# Altium schematic sheet M3_FMCW.SchDoc
size C
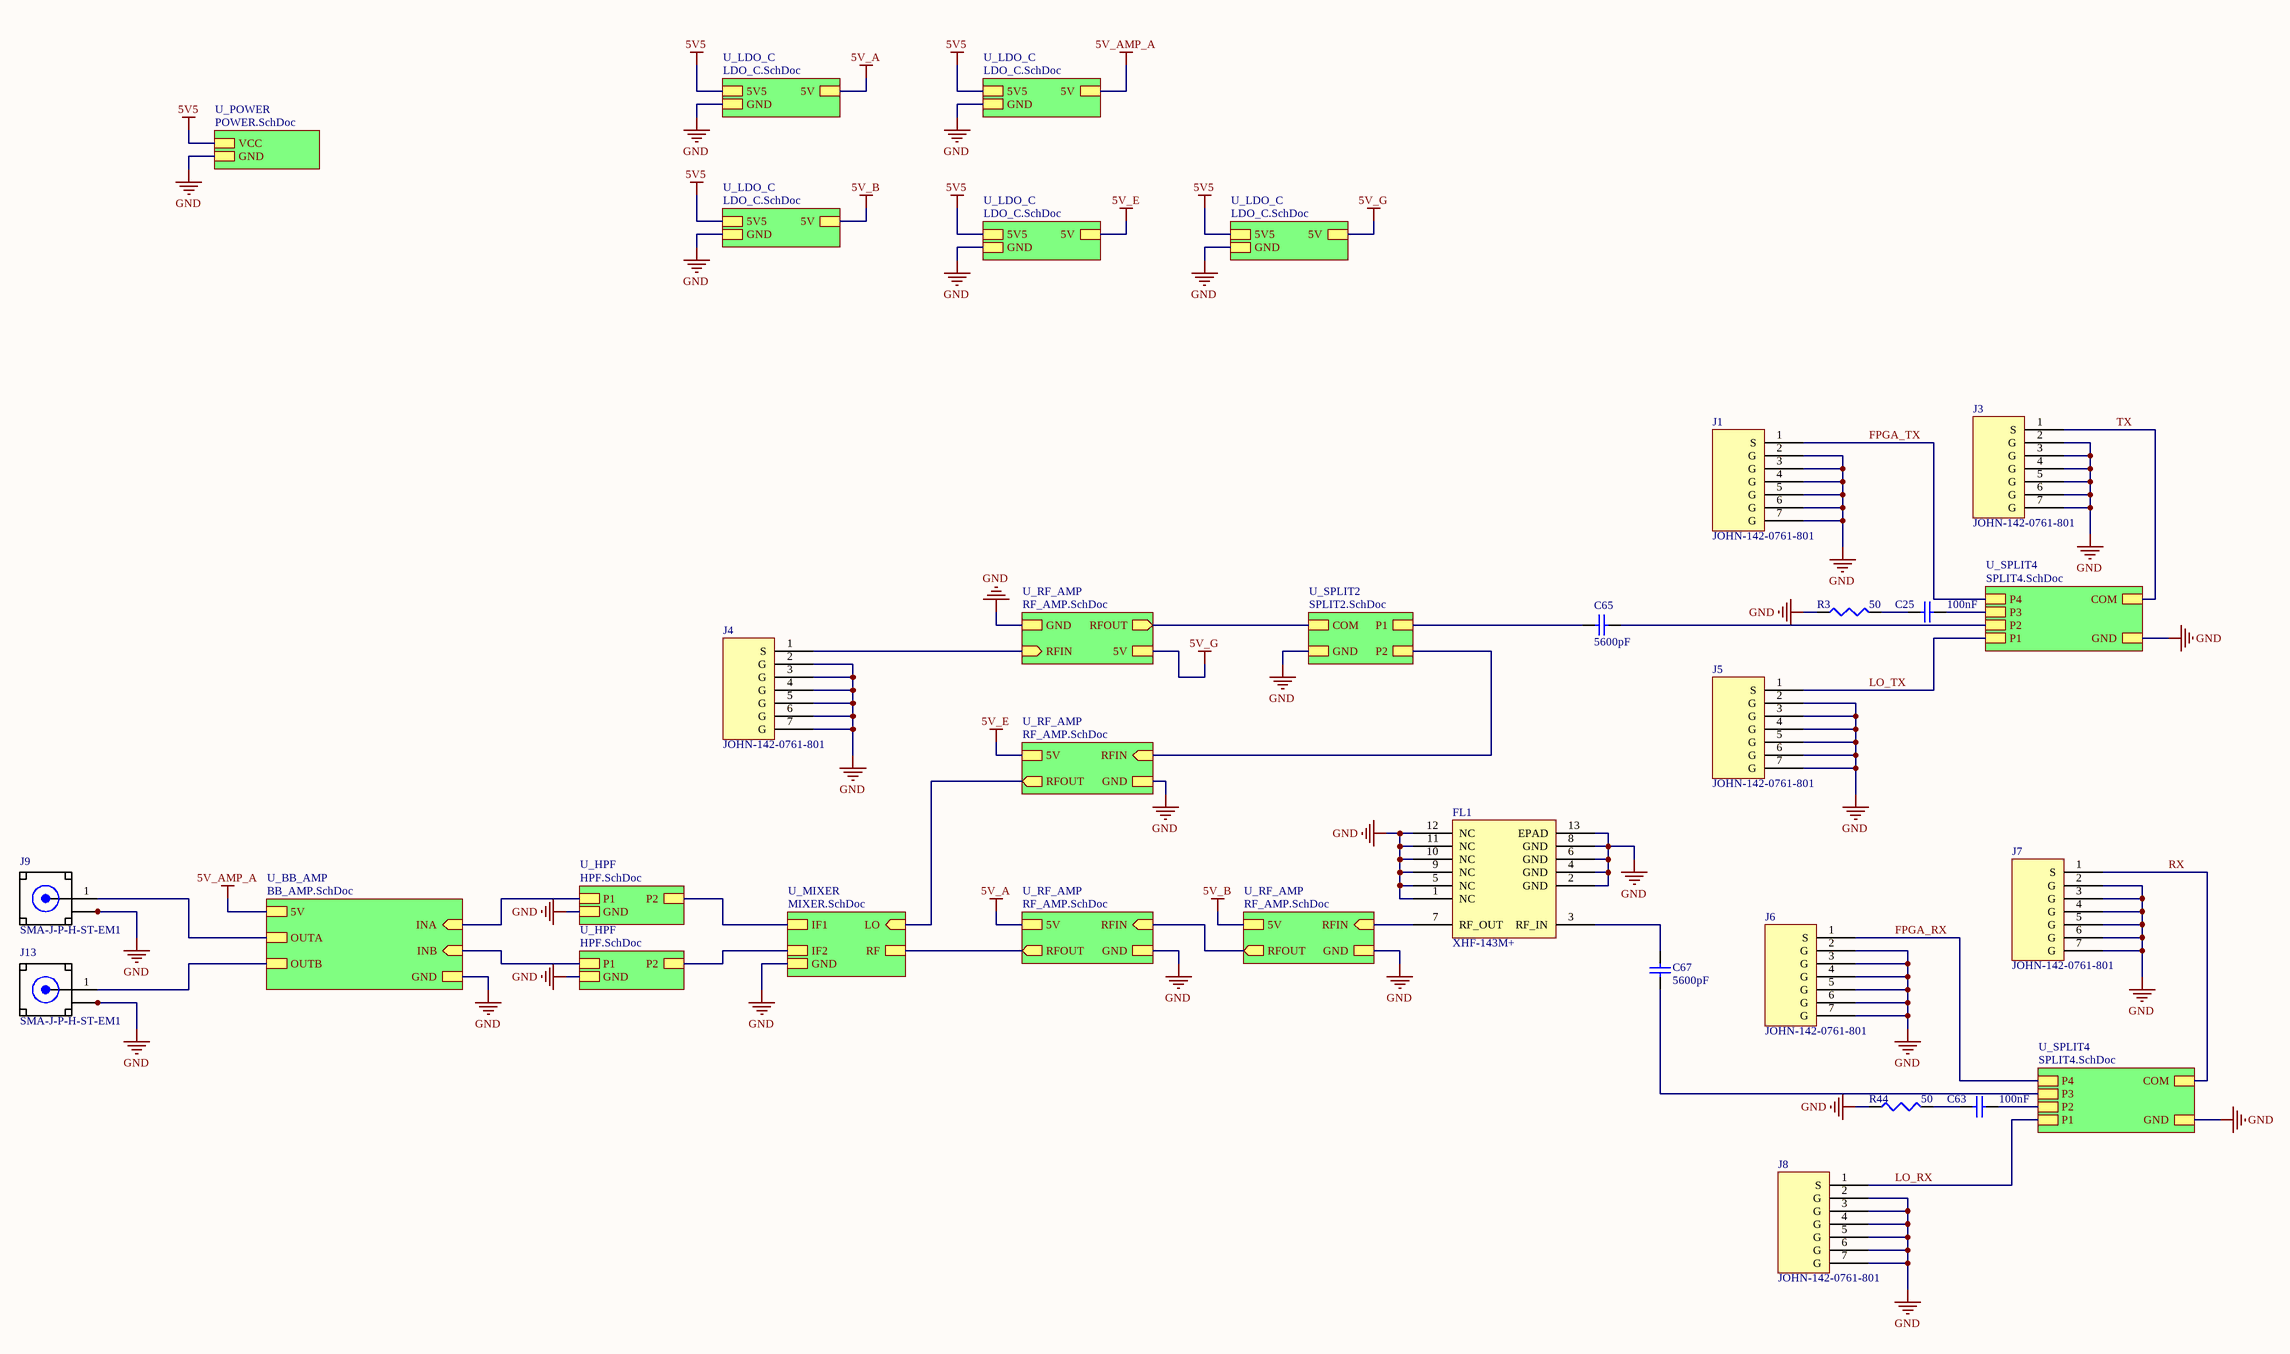
[diagram p0: M3_FMCW.SchDoc]

## Parts
C25  100nF  [SMD-0402]
C63  100nF  [SMD-0402]
C65  5600pF  [Johanson-0201]
C67  5600pF  [Johanson-0201]
FL1  XHF-143M+  [PQFN12-XHF-143M]
J1  JOHN-142-0761-801  [JOHN-142-0761-801]
J3  JOHN-142-0761-801  [JOHN-142-0761-801]
J4  JOHN-142-0761-801  [JOHN-142-0761-801]
J5  JOHN-142-0761-801  [JOHN-142-0761-801]
J6  JOHN-142-0761-801  [JOHN-142-0761-801]
J7  JOHN-142-0761-801  [JOHN-142-0761-801]
J8  JOHN-142-0761-801  [JOHN-142-0761-801]
J9  SMA-J-P-H-ST-EM1  [SMA-J-P-H-ST-EM1]
J13  SMA-J-P-H-ST-EM1  [SMA-J-P-H-ST-EM1]
R3  50  [SMD-0402]
R44  50  [SMD-0402]

## Sub-sheets
U_BB_AMP = BB_AMP.SchDoc: OUTA, OUTB, INA (in), INB (in), 5V, GND
U_HPF = HPF.SchDoc: P1, P2, GND
U_HPF = HPF.SchDoc: P1, P2, GND
U_LDO_C = LDO_C.SchDoc: 5V, 5V5, GND
U_LDO_C = LDO_C.SchDoc: 5V, 5V5, GND
U_LDO_C = LDO_C.SchDoc: 5V, 5V5, GND
U_LDO_C = LDO_C.SchDoc: 5V, 5V5, GND
U_LDO_C = LDO_C.SchDoc: 5V, 5V5, GND
U_MIXER = MIXER.SchDoc: IF1, IF2, LO (in), RF, GND
U_POWER = POWER.SchDoc: GND, VCC
U_RF_AMP = RF_AMP.SchDoc: 5V, RFIN (in), RFOUT (out), GND
U_RF_AMP = RF_AMP.SchDoc: 5V, RFIN (in), RFOUT (out), GND
U_RF_AMP = RF_AMP.SchDoc: 5V, RFIN (in), RFOUT (out), GND
U_RF_AMP = RF_AMP.SchDoc: 5V, RFIN (in), RFOUT (out), GND
U_SPLIT2 = SPLIT2.SchDoc: COM, P1, P2, GND
U_SPLIT4 = SPLIT4.SchDoc: COM, P1, P2, P3, P4, GND
U_SPLIT4 = SPLIT4.SchDoc: COM, P1, P2, P3, P4, GND

## Nets
5V5: sheet U_LDO_C/5V5, sheet U_POWER/VCC, sheet U_LDO_C/5V5, sheet U_LDO_C/5V5, sheet U_LDO_C/5V5, sheet U_LDO_C/5V5
5V_A: sheet U_LDO_C/5V, sheet U_RF_AMP/5V
5V_AMP_A: sheet U_BB_AMP/5V, sheet U_LDO_C/5V
5V_B: sheet U_LDO_C/5V, sheet U_RF_AMP/5V
5V_E: sheet U_RF_AMP/5V, sheet U_LDO_C/5V
5V_G: sheet U_RF_AMP/5V, sheet U_LDO_C/5V
GND: FL1.1(NC) FL1.2(GND) FL1.4(GND) FL1.5(NC) FL1.6(GND) FL1.8(GND) FL1.9(NC) FL1.10(NC) FL1.11(NC) FL1.12(NC) FL1.13(EPAD) J1.2(G) J1.3(G) J1.4(G) J1.5(G) J1.6(G) J1.7(G) J3.2(G) J3.3(G) J3.4(G) J3.5(G) J3.6(G) J3.7(G) J4.2(G) J4.3(G) J4.4(G) J4.5(G) J4.6(G) J4.7(G) J5.2(G) J5.3(G) J5.4(G) J5.5(G) J5.6(G) J5.7(G) J6.2(G) J6.3(G) J6.4(G) J6.5(G) J6.6(G) J6.7(G) J7.2(G) J7.3(G) J7.4(G) J7.5(G) J7.6(G) J7.7(G) J8.2(G) J8.3(G) J8.4(G) J8.5(G) J8.6(G) J8.7(G) J9.2_1(GND) J9.2_2(GND) J9.3_1(GND) J9.3_2(GND) J13.2_1(GND) J13.2_2(GND) J13.3_1(GND) J13.3_2(GND) R3.1 R44.1 ; sheet U_LDO_C/GND, sheet U_POWER/GND, sheet U_LDO_C/GND, sheet U_MIXER/GND, sheet U_BB_AMP/GND, sheet U_LDO_C/GND, sheet U_HPF/GND, sheet U_HPF/GND, sheet U_RF_AMP/GND, sheet U_RF_AMP/GND, sheet U_SPLIT4/GND, sheet U_SPLIT4/GND, sheet U_RF_AMP/GND, sheet U_LDO_C/GND, sheet U_RF_AMP/GND, sheet U_LDO_C/GND, sheet U_SPLIT2/GND
FPGA_RX: J6.1(S) ; sheet U_SPLIT4/P4
FPGA_TX: J1.1(S) ; sheet U_SPLIT4/P4
LO_RX: J8.1(S) ; sheet U_SPLIT4/P1
LO_TX: J5.1(S) ; sheet U_SPLIT4/P1
RX: J7.1(S) ; sheet U_SPLIT4/COM
TX: J3.1(S) ; sheet U_SPLIT4/COM
NetC25_1: C25.1 R3.2
NetC25_2: C25.2 ; sheet U_SPLIT4/P3
NetC63_1: C63.1 R44.2
NetC63_2: C63.2 ; sheet U_SPLIT4/P2
NetC65_1: C65.1 ; sheet U_SPLIT4/P2
NetC65_2: C65.2 ; sheet U_SPLIT2/P1
NetC67_1: C67.1 ; sheet U_SPLIT4/P3
NetC67_2: C67.2 FL1.3(RF_IN)
NetFL1_7: FL1.7(RF_OUT) ; sheet U_RF_AMP/RFIN
NetJ4_1: J4.1(S) ; sheet U_RF_AMP/RFIN
NetJ9_1: J9.1(SIGNAL) ; sheet U_BB_AMP/OUTA
NetJ13_1: J13.1(SIGNAL) ; sheet U_BB_AMP/OUTB
(unnamed): sheet U_MIXER/IF1, sheet U_HPF/P2
(unnamed): sheet U_MIXER/IF2, sheet U_HPF/P2
(unnamed): sheet U_MIXER/LO, sheet U_RF_AMP/RFOUT
(unnamed): sheet U_MIXER/RF, sheet U_RF_AMP/RFOUT
(unnamed): sheet U_BB_AMP/INA, sheet U_HPF/P1
(unnamed): sheet U_BB_AMP/INB, sheet U_HPF/P1
(unnamed): sheet U_RF_AMP/RFIN, sheet U_RF_AMP/RFOUT
(unnamed): sheet U_RF_AMP/RFIN, sheet U_SPLIT2/P2
(unnamed): sheet U_RF_AMP/RFOUT, sheet U_SPLIT2/COM

## Notes on the sheet
- Title
- Size:
- Date:
- File:
- C
- Number:
- Time:
- Revision:
- Sheet
- of

## Library data of the parts
C25 C63 = CAP_RF_0402: Broadband Ceramic Capacitor X7R 0402 (1005 Metric)
C65 C67 = CAP_RF_0201: Broadband Capacitor 0201 Imperial
FL1 = XHF-143M+: Reflectionless High Pass Filter 50Ω 13900 to19000 MHz
J1 J3-J8 = JOHN-142-0761-801: CONN SMA JACK STR 50OHM EDGE MNT
J9 J13 = SMA-J-P-H-ST-EM1: Connector SMA F 50Ohm Solder ST Edge Mount Gold Over Nickel Tray; MF: Samtec; Price: None; SnapEDA_Link: https://www.snapeda.com/parts/SMA-J-P-H-ST-EM1/Samtec%20Inc./view-part/?ref=snap; MP: SMA-J-P-H-ST-EM1; Package: None; Availability: Unavailable; Value: *
R3 R44 = RES_RF_0402: High Frequency Resistor 0402